# EAGLE design output board (EAGLE 9.6.2)
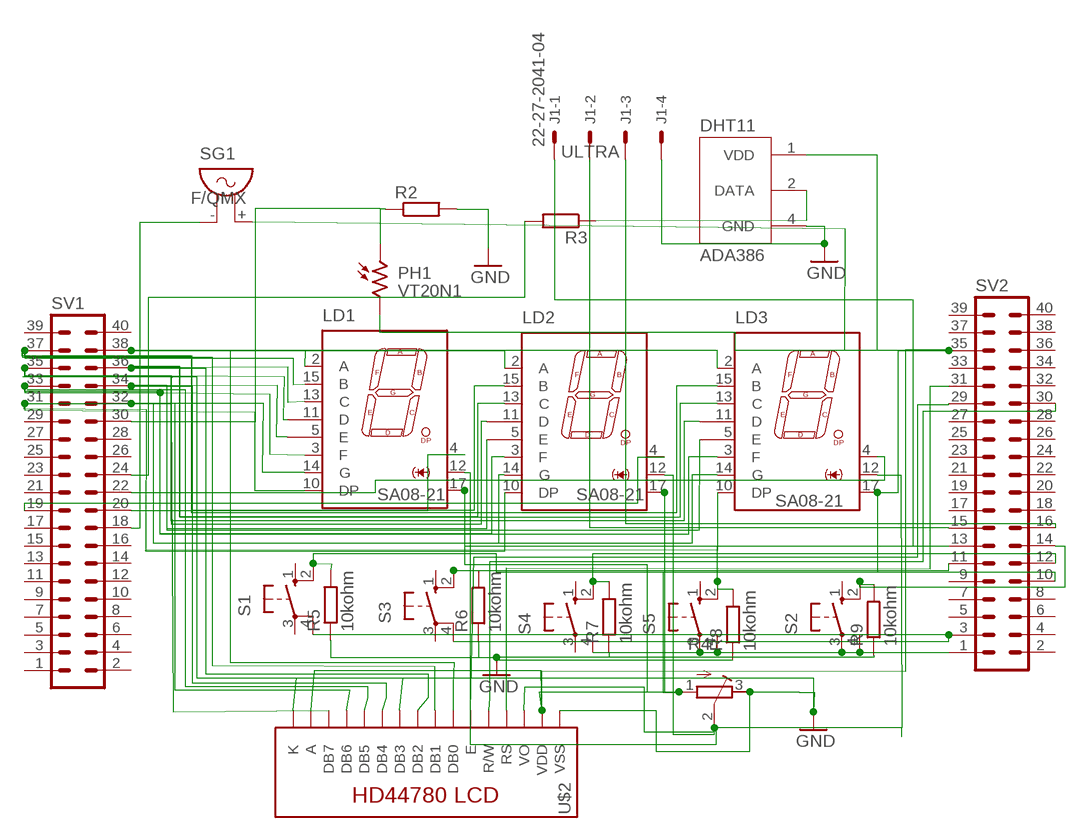
[diagram p0: schematic, sheet 1]

## Parts
DHT11  ADA386  [XDCR_ADA386]
J1  22-27-2041-04  [6410-04]
LD1  SA08-21  [SA08-21]
LD2  SA08-21  [SA08-21]
LD3  SA08-21  [SA08-21]
PH1  VT20N1  [TO46-VT200]
R2  R-EU_M0805  [M0805]
R3  R-EU_M0805  [M0805]
R4  R-TRIMM3224J  [RTRIM3224J]
R5  10kohm  R-EU_R0201  [R0201]
R6  10kohm  R-EU_R0201  [R0201]
R7  10kohm  R-EU_R0201  [R0201]
R8  10kohm  R-EU_R0201  [R0201]
R9  10kohm  R-EU_R0201  [R0201]
S1  10-XX  [B3F-10XX]
S2  10-XX  [B3F-10XX]
S3  10-XX  [B3F-10XX]
S4  10-XX  [B3F-10XX]
S5  10-XX  [B3F-10XX]
SG1  F/QMX  [F/QMX]
SV1  40P  [40P]
SV2  40P  [40P]
U$2  LCD-HD447803-HOLES16X2-3-HOLES  [LCD-16X2-3HOLES]

## Nets
GND: DHT11.4(GND) J1.4 R2.2 R4.3(E) R5.1 R6.1 R7.1 R8.1 R9.1 U$2.1(VSS) U$2.16(K)
N$1: DHT11.2(DATA) R3.1
N$2: U$2.12(DB5)
N$3: LD1.2(A) LD2.2(A) LD3.2(A) SV1.38 U$2.7(DB0)
N$4: LD1.15(B) LD2.15(B) LD3.15(B) SV1.37 U$2.8(DB1)
N$5: LD1.13(C) LD2.13(C) LD3.13(C) SV1.36 U$2.9(DB2)
N$6: LD1.9(D) LD2.9(D) LD3.9(D) SV1.35
N$7: LD1.7(E) LD2.7(E) LD3.7(E) SV1.34 U$2.11(DB4)
N$8: LD1.3(F) LD2.3(F) LD3.3(F) SV1.33
N$9: LD1.14(G) LD2.14(G) LD3.14(G) SV1.32 U$2.13(DB6)
N$10: LD1.10(DP) LD2.10(DP) LD3.10(DP) SV1.31 U$2.14(DB7)
N$11: SV2.29 U$2.6(E)
N$12: SV2.30 U$2.5(R/W)
N$13: SV2.31 U$2.4(RS)
N$14: LD1.12(AN) LD2.12(AN) LD3.12(AN) R4.2(S) U$2.3(VO)
N$15: PH1.1 R2.1
N$16: R5.2 S1.2(S1) SV2.10
N$17: U$2.10(DB3)
N$18: R6.2 S3.2(S1) SV2.11
N$19: R7.2 S4.2(S1) SV2.12
N$20: LD1.4(AN) SV1.20
N$21: LD2.4(AN) SV1.19
N$22: LD3.4(AN) SV1.22
N$23: R8.2 S5.2(S1) SV2.13
N$24: R9.2 S2.2(S1) SV2.14
N$25: S1.4(P1) S3.4(P1) SV2.3
N$26: S2.3(P) S2.4(P1) S4.4(P1) S5.3(P) S5.4(P1) SV2.1
N$27: R3.2 SV1.24
N$28: SV1.30
N$29: J1.2 SV2.15
N$30: SG1.- SV1.18
N$32: J1.3 SV2.16
ULTRA: DHT11.1(VDD) J1.1 LD1.17(AN) LD2.17(AN) LD3.17(AN) PH1.2 R4.1(A) SG1.+ SV2.35 U$2.2(VDD) U$2.15(A)
Unconnected: LD1.5(E) LD1.11(D) LD2.5(E) LD2.11(D) LD3.5(E) LD3.11(D) S1.1(S) S1.3(P) S2.1(S) S3.1(S) S3.3(P) S4.1(S) S4.3(P) S5.1(S) SV1.1 SV1.2 SV1.3 SV1.4 SV1.5 SV1.6 SV1.7 SV1.8 SV1.9 SV1.10 SV1.11 SV1.12 SV1.13 SV1.14 SV1.15 SV1.16 SV1.17 SV1.21 SV1.23 SV1.25 SV1.26 SV1.27 SV1.28 SV1.29 SV1.39 SV1.40 SV2.2 SV2.4 SV2.5 SV2.6 SV2.7 SV2.8 SV2.9 SV2.17 SV2.18 SV2.19 SV2.20 SV2.21 SV2.22 SV2.23 SV2.24 SV2.25 SV2.26 SV2.27 SV2.28 SV2.32 SV2.33 SV2.34 SV2.36 SV2.37 SV2.38 SV2.39 SV2.40

## Library data of the parts
DHT11 = ADA386:ADA386: DHT11 basic temperature-humidity sensor + extras; AVAILABILITY: Unavailable; DESCRIPTION: DHT11 basic temperature-humidity sensor + extras; MF: Adafruit Industries; MP: ADA386; PACKAGE: None; PRICE: None
J1 = con-molex:22-?-04: CONNECTOR wire to board 2.54 mm (.1 inch) pitch header; MF: MOLEX; OC_FARNELL: unknown; OC_NEWARK: unknown
LD1-LD3 = led:SA08-21: Kingbright 20mm (0.8Inch) Single Digit Numeric Display Source: SA08-11SRWA.pdf
PH1 = photo-elements:VT2*: Photoconductive Cell VT200 Series Source: http://optoelectronics.perkinelmer.com/content/Datasheets/DTS_vt200seriesdatasheet.pdf
R2 R3 R5-R9 = rcl:R-EU_: RESISTOR, European symbol; SPICEPREFIX: R
R4 = rcl:R-TRIMM: Trimm resistor; SPICEMODEL: X; SPICEPREFIXL: POT
S1-S5 = switch-omron:10-XX: OMRON SWITCH; MPN: B3F-1000; OC_FARNELL: 176432; OC_NEWARK: 36M3542
SG1 = buzzer:F/QMX: BUZZER Source: Buerklin; OC_FARNELL: unknown; OC_NEWARK: unknown
SV1 SV2 = con-dil:40P: DIL CABLE CONNECTOR
U$2 = HD44780LCD:LCD-HD44780

## Board
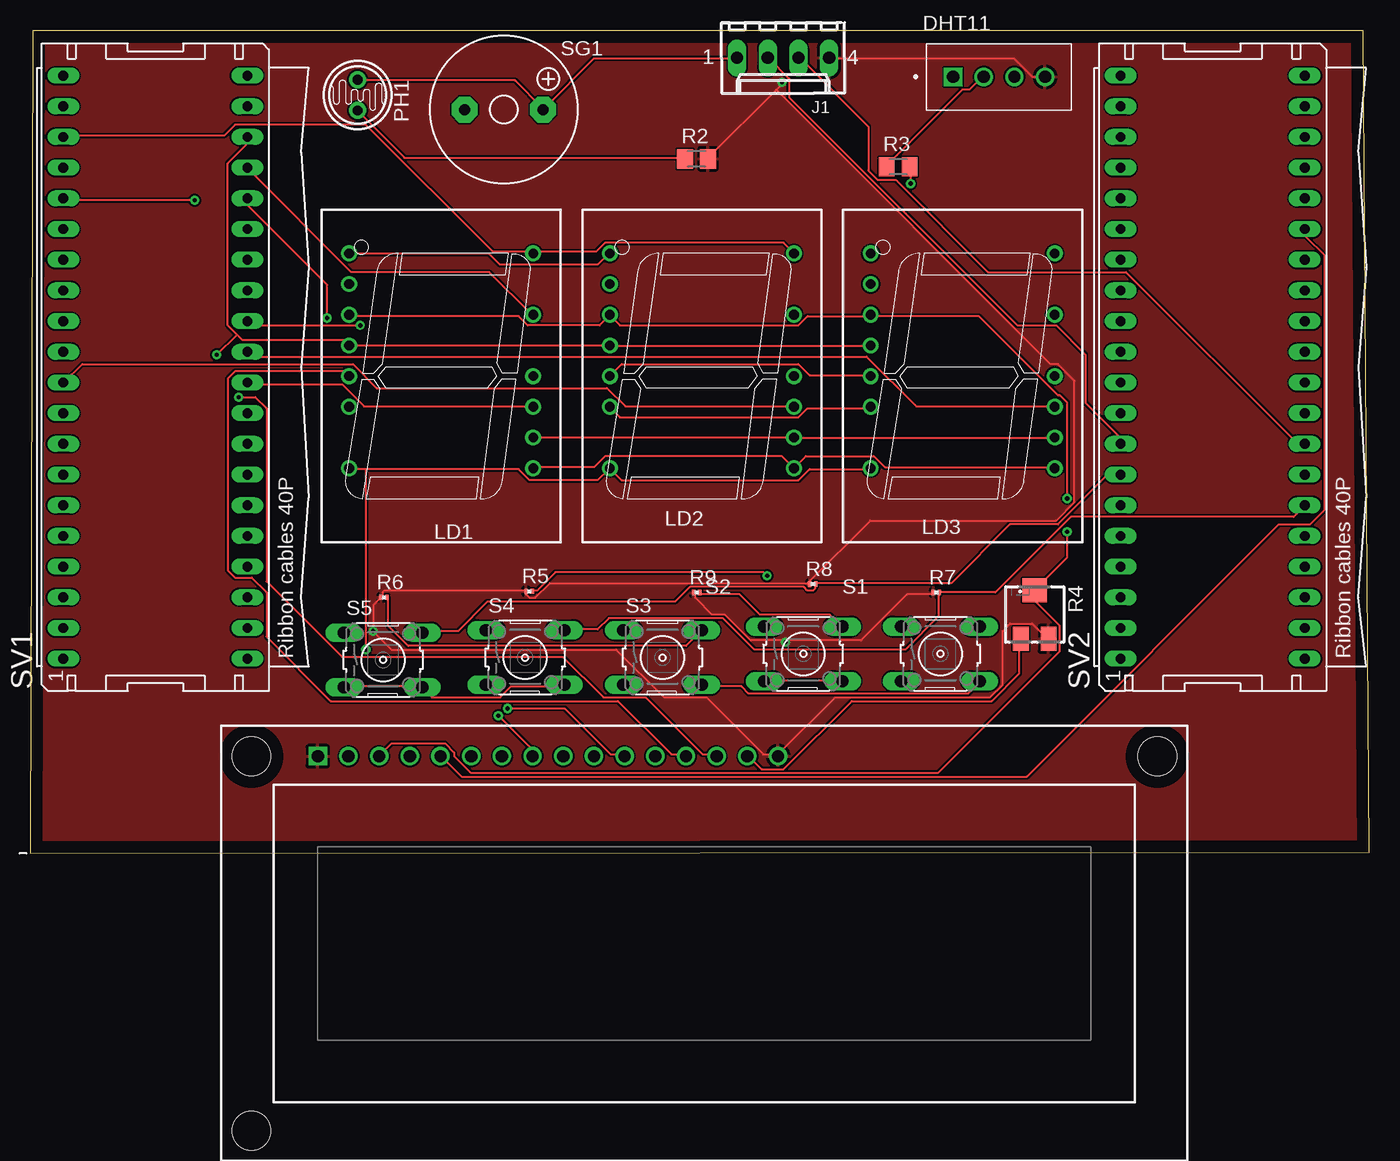
[diagram p1: board, top side]
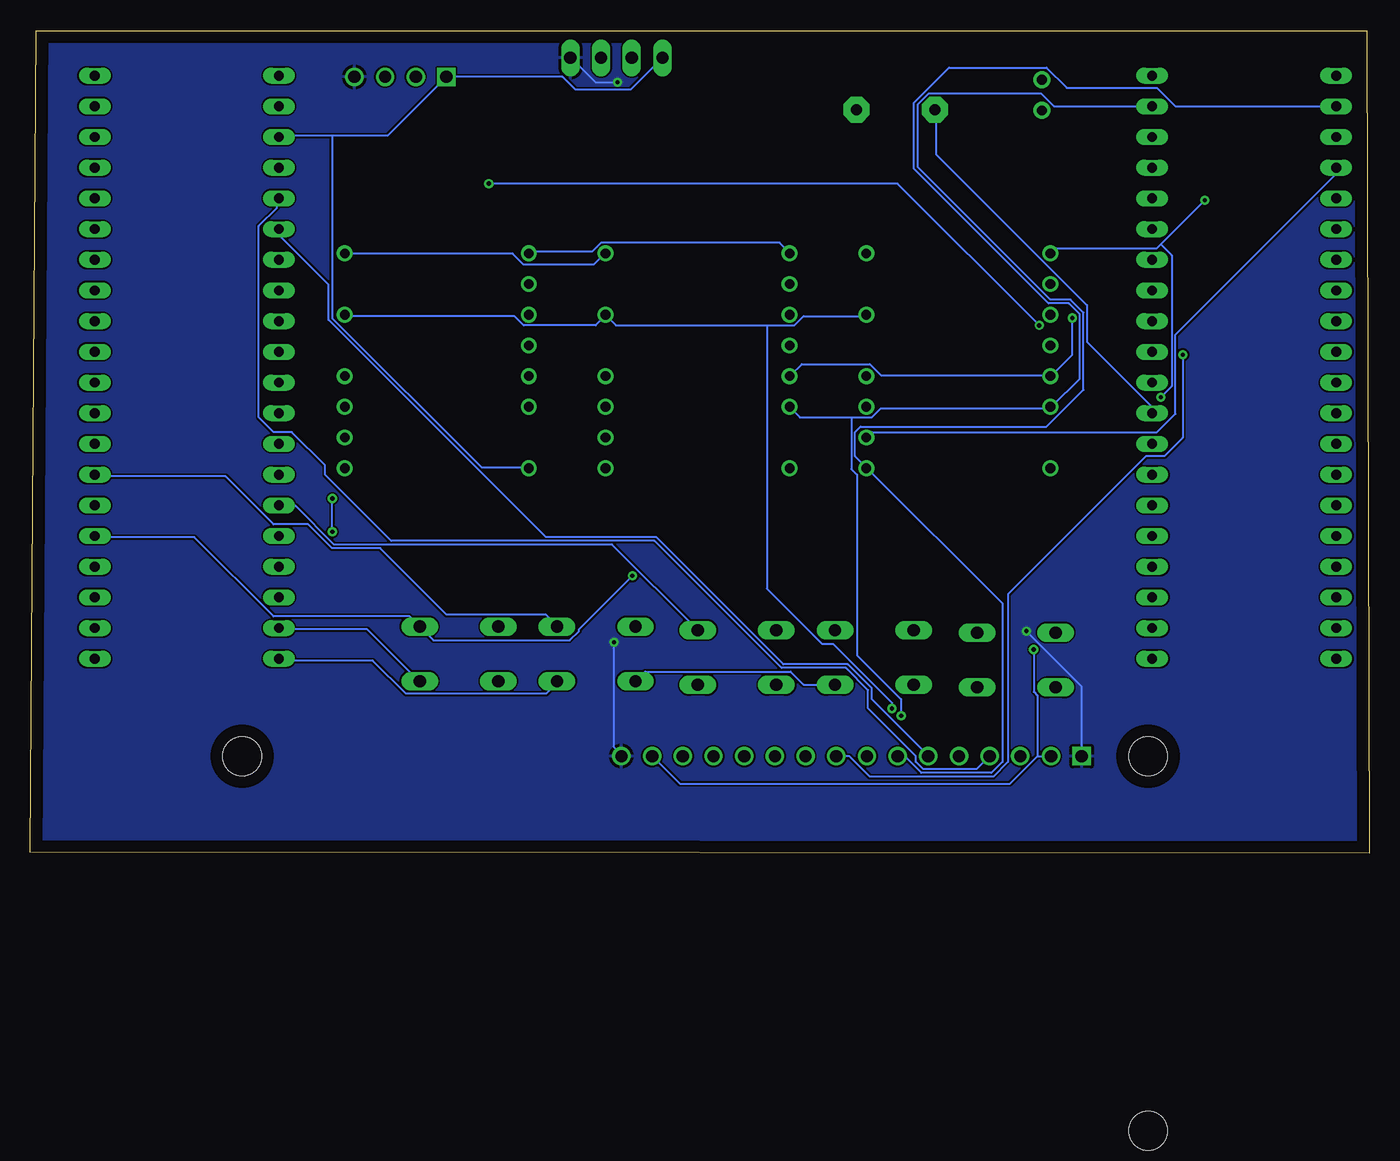
[diagram p2: board, bottom side, seen from below]

Size 110.86 x 68.06 mm. Coordinates in mm from the lower left corner, seen from the top.
Outline: 0,0 110.86,0.1 110.36,68.06 0.2,68.06 0,0
Copper layers (1*16): Top 0.035mm / dielectric 1.5mm / Bottom 0.035mm
Design rules "default": minimum track width 6mil, minimum drill 0.35mm, track to track 6mil, track to pad 6mil, pad to pad 6mil, via to via 6mil, smd to smd 6mil, copper to edge 40mil, drill to drill 6mil, minimum pad ring 10mil, minimum via ring 8mil, stop-mask expansion 4mil, vias tented up to drill 0mil, thermal gap 10mil

### Footprints (pad centres in the part's own frame; a part is rotated, then mirrored left to right if it is on the bottom)
XDCR_ADA386 = drill 1.016 square: 1 -3.81,0 | drill 1.016: 2 -1.27,0; 3 1.27,0; 4 3.81,0
6410-04 = drill 1.016 long: 1 3.81,0; 2 1.27,0; 3 -1.27,0; 4 -3.81,0
SA08-21 = drill 0.8 pad 1.27: 2 -7.62,7.62; 3 -7.62,5.08; 4 -7.62,2.54; 5 -7.62,0; 7 -7.62,-5.08; 9 -7.62,-10.16; 10 7.62,-10.16; 11 7.62,-7.62; 12 7.62,-5.08; 13 7.62,-2.54; 14 7.62,0; 15 7.62,2.54; 17 7.62,7.62
TO46-VT200 = drill 0.8 pad 1.4: 1 -1.27,0; 2 1.27,0
M0805 = smd 1.3 x 1.6: 1 -0.95,0; 2 0.95,0
RTRIM3224J = smd 1.3 x 2: 1 -1.15,-2; 3 1.15,-2 | smd 2 x 2: 2 0,2
R0201 = smd 0.28 x 0.43: 1 -0.255,0; 2 0.255,0
B3F-10XX = drill 1.016 long: 1 -3.251,2.261; 2 3.251,2.261; 3 -3.251,-2.261; 4 3.251,-2.261
F/QMX = drill 0.914 pad 2.159 octagon: + 3.251,0; - -3.251,0
40P = drill 0.813 long: 1 -24.13,7.62; 2 -24.13,-7.62; 3 -21.59,7.62; 4 -21.59,-7.62; 5 -19.05,7.62; 6 -19.05,-7.62; 7 -16.51,7.62; 8 -16.51,-7.62; 9 -13.97,7.62; 10 -13.97,-7.62; 11 -11.43,7.62; 12 -11.43,-7.62; 13 -8.89,7.62; 14 -8.89,-7.62; 15 -6.35,7.62; 16 -6.35,-7.62; 17 -3.81,7.62; 18 -3.81,-7.62; 19 -1.27,7.62; 20 -1.27,-7.62; 21 1.27,7.62; 22 1.27,-7.62; 23 3.81,7.62; 24 3.81,-7.62; 25 6.35,7.62; 26 6.35,-7.62; 27 8.89,7.62; 28 8.89,-7.62; 29 11.43,7.62; 30 11.43,-7.62; 31 13.97,7.62; 32 13.97,-7.62; 33 16.51,7.62; 34 16.51,-7.62; 35 19.05,7.62; 36 19.05,-7.62; 37 21.59,7.62; 38 21.59,-7.62; 39 24.13,7.62; 40 24.13,-7.62
LCD-16X2-3HOLES = drill 1.016 square: 1 -32,15.5 | drill 1.016: 2 -29.46,15.5; 3 -26.92,15.5; 4 -24.38,15.5; 5 -21.84,15.5; 6 -19.3,15.5; 7 -16.76,15.5; 8 -14.22,15.5; 9 -11.68,15.5; 10 -9.14,15.5; 11 -6.6,15.5; 12 -4.06,15.5; 13 -1.52,15.5; 14 1.02,15.5; 15 3.56,15.5; 16 6.1,15.5 | hole 3.2: -37.5,15.5; -37.5,-15.5; 37.5,15.5

### Placement (x,y rotation side)
DHT11  80.21,64.26 0 top
J1  62.33,65.83 180 top
LD1  34.02,39.49 180 top
LD2  55.61,39.49 180 top
LD3  77.2,39.49 180 top
PH1  27.11,62.75 90 top
R2  55.16,57.47 0 top
R3  71.86,56.81 0 top
R4  83.16,19.76 0 top
R5  41.31,21.68 0 top
R6  29.29,21.18 0 top
R7  75.02,21.58 0 top
R8  64.8,22.28 0 top
R9  55.18,21.58 0 top
S1  75.36,16.5 0 top
S2  64,16.5 0 top
S3  52.34,16.2 0 top
S4  40.98,16.2 0 top
S5  29.22,16 0 top
SG1  39.21,61.55 0 top
SV1  10.36,40.23 90 top
SV2  97.89,40.23 90 top
U$2  55.81,-7.46 0 top

### Tracks (layer width: path | path; a pad name or v marks a point on that pad's centre or on a via)
GND  (via drill 0.35)
  Top 0.152: 62.53,17.63 68.78,17.63 72.59,21.44 74.72,21.44 R7.1 | 62.53,17.63 59.64,17.63 57.5,19.76 56.44,19.76 55.06,21.13 55.06,21.44 R9.1 | R4.3 84.17,17.78 82.95,19 81.12,19 80.52,18.39 80.52,13.97 79.45,12.9 66.65,12.9 61.92,8.18 U$2.16 61.77,8.18 60.7,8.18 55.98,12.9 52.47,12.9 48.51,16.86 29.92,16.86 v28.39,18.39 28.39,20.52 29,21.13 R6.1 29.16,21.28 29.16,21.59 29.31,21.74 41.04,21.74 R5.1 41.04,21.59 41.04,21.44 41.35,21.13 41.8,21.13 43.02,22.35 64.36,22.35 | v62.53,17.47 62.53,17.63 | 61.77,63.19 62.23,63.65 v62.23,63.8 | 61.77,63.19 56.13,57.55 R2.2 | DHT11.4 82.95,64.26 81.43,65.78 66.19,65.78 J1.4 | 64.36,22.35 64.51,22.35 R8.1 | 61.77,63.19 84.48,40.49 85.09,40.49 86.46,39.11 86.46,29.06 84.93,27.53 69.54,27.53 64.36,22.35
  Bottom 0.152: v62.53,17.47 62.53,8.79 61.92,8.18 U$2.16 | v62.23,63.8 64.06,63.8 66.04,65.78 J1.4 | v28.39,18.39 23.82,13.82 23.82,8.18 U$2.1
  pour Top: -3.1,69.6 112.6,69.6 112.6,-23 112.6,-26.7 -4.9,-26.7 -4.9,69.6
  pour Bottom: -6.1,70.8 113.6,70.8 113.6,-28.1 -6.1,-28.1
N$1
  Top 0.152: R3.1 70.91,56.95 77.16,63.19 77.77,63.19 78.84,64.26 DHT11.2
N$3
  Top 0.152: LD1.2 41.65,31.95 46.68,31.95 47.6,32.87 62.23,32.87 63.14,31.95 LD2.2 63.29,31.95 64.21,32.87 69.85,32.87 70.76,31.95 84.78,31.95 LD3.2
  Bottom 0.152: SV1.38 18.03,61.82 26.11,61.82 27.18,62.89 36.47,62.89 37.39,61.97 37.39,56.79 26.41,45.82 24.74,45.82 23.67,44.75 23.67,38.35 26.72,35.3 42.11,35.3 42.57,34.85 42.57,32.87 41.65,31.95 LD1.2 41.5,31.8 30.38,20.67 30.38,7.57 31.29,6.65 37.08,6.65 38.45,8.02 38.91,8.02 U$2.7
N$4  (via drill 0.35)
  Top 0.152: LD3.15 69.54,36.83 64.36,36.83 63.6,36.07 48.82,36.07 48.05,36.83 LD2.15 | v38.76,11.38 41.5,8.63 41.5,8.18 U$2.8
  Bottom 0.152: 42.87,36.07 47.14,36.07 47.9,36.83 LD2.15 | 42.87,36.07 41.2,36.07 40.43,36.83 26.41,36.83 LD1.15 26.26,36.98 23.97,39.27 23.97,44.6 24.89,45.52 26.56,45.52 37.69,56.64 37.69,62.13 34.8,65.02 26.72,65.02 25.04,63.35 17.57,63.35 16.05,61.82 2.79,61.82 SV1.37 | v38.76,11.38 38.76,12.75 42.42,16.41 42.42,31.34 42.87,31.8 42.87,36.07
N$5  (via drill 0.35)
  Top 0.152: LD3.13 69.54,42.01 48.05,42.01 LD2.13 47.9,42.01 26.41,42.01 LD1.13 26.26,42.16 25.96,42.47 17.57,42.47 17.12,42.92 | 17.12,42.92 16.35,43.69 16.35,57.1 17.88,58.62 17.88,59.23 SV1.36 | 17.12,42.92 v15.44,41.25
  Bottom 0.152: v15.44,41.25 15.44,34.39 16.96,32.87 18.49,32.87 29.92,21.44 29.92,7.57 31.14,6.35 41.35,6.35 43.02,8.02 44.09,8.02 U$2.9
N$6
  Top 0.152: LD2.9 63.14,49.78 62.38,50.54 47.6,50.54 46.83,49.78 41.65,49.78 LD1.9 41.5,49.78 38.3,49.78 27.78,60.3 16.96,60.3 16.05,59.38 2.79,59.38 SV1.35
  Bottom 0.152: LD3.9 84.78,49.63 70.91,49.63 70,48.71 64.21,48.71 63.29,49.63 LD2.9
N$7  (via drill 0.35)
  Top 0.152: SV1.34 18.03,56.64 26.56,48.11 38,48.11 41.5,44.6 LD1.7 | v39.52,11.99 44.24,11.99 48.05,8.18 49.12,8.18 U$2.11
  Bottom 0.152: 49.88,43.69 62.38,43.69 63.14,44.45 LD2.7 63.29,44.45 64.06,43.69 70,43.69 70.76,44.45 84.78,44.45 LD3.7 | 49.88,43.69 47.6,43.69 46.83,44.45 41.65,44.45 LD1.7 | v39.52,11.99 39.52,12.44 44.4,17.32 45.31,17.32 49.88,21.89 49.88,43.69
N$8
  Top 0.152: LD1.3 41.65,34.39 63.14,34.39 LD2.3 63.29,34.39 84.78,34.39 LD3.3
  Bottom 0.152: SV1.33 2.79,56.64 2.79,56.18 16.05,42.92 16.05,36.37 17.57,34.85 41.2,34.85 41.5,34.54 LD1.3
N$9  (via drill 0.35)
  Top 0.152: LD3.14 69.54,39.57 64.51,39.57 63.6,40.49 48.97,40.49 48.05,39.57 LD2.14 | v24.58,44.3 24.58,47.04 18.03,53.59 18.03,54.05 SV1.32 | U$2.13 54.15,8.18 53.08,8.18 48.66,12.6 24.89,12.6 19.55,17.93 19.55,21.59 18.34,22.81 16.96,22.81 16.35,23.42 16.35,39.27 16.96,39.88 25.96,39.88 26.26,39.57 LD1.14
  Bottom 0.152: LD2.14 47.9,39.57 46.99,40.49 41.35,40.49 40.43,39.57 26.41,39.57 LD1.14 26.26,39.57 24.58,41.25 v24.58,44.3
N$10  (via drill 0.35)
  Top 0.152: LD1.10 26.41,49.63 38,49.63 38.91,48.71 46.99,48.71 47.9,49.63 LD2.10 | v13.61,54.05 2.79,54.05 SV1.31 | v17.27,37.74 18.64,37.74 19.55,36.83 19.55,22.5 25.8,16.25 44.09,16.25 47.44,12.9 50.95,12.9 55.67,8.18 56.74,8.18 U$2.14
  Bottom 0.152: LD3.10 69.54,49.78 64.36,49.78 63.6,50.54 48.82,50.54 48.05,49.78 LD2.10 | 17.27,50.39 17.57,50.09 25.96,50.09 26.26,49.78 LD1.10 | 17.27,50.39 v13.61,54.05 | v17.27,37.74 16.35,38.66 16.35,49.48 17.27,50.39
N$11
  Bottom 0.152: SV2.29 90.27,51.61 90.27,51.15 86.15,47.04 86.15,44.14 68.17,26.16 59.03,26.16 48.51,15.64 43.18,15.64 41.2,13.66 41.2,12.75 36.62,8.18 U$2.6
N$12
  Top 0.152: SV2.30 105.66,51.61 105.66,51 107.19,49.48 107.19,28.45 105.97,27.23 103.38,27.23 82.5,6.35 35.71,6.35 34.03,8.02 U$2.5
N$13
  Bottom 0.152: SV2.31 90.42,54.05 90.42,53.44 91.95,51.92 91.95,36.07 90.73,34.85 89.2,34.85 86.46,32.1 86.46,31.34 80.97,25.86 59.18,25.86 48.66,15.34 43.33,15.34 41.5,13.51 41.5,11.99 37.54,8.02 37.54,7.57 36.93,6.96 32.51,6.96 31.44,8.02 U$2.4
N$14  (via drill 0.35)
  Top 0.152: LD1.12 26.41,44.45 40.43,44.45 41.2,43.69 47.14,43.69 47.9,44.45 LD2.12 48.05,44.45 48.82,43.69 63.6,43.69 64.36,44.45 69.54,44.45 LD3.12 69.69,44.45 78.53,44.45 85.09,37.89 85.24,37.89 85.85,37.28 v85.85,29.36 | U$2.3 29,8.18 29.92,9.09 34.34,9.09 35.1,8.33 35.1,8.02 36.47,6.65 75.18,6.65 85.24,16.71 85.24,18.84 83.26,20.83 83.26,21.74 R4.2 83.26,21.89 85.85,24.48 v85.85,26.62
  Bottom 0.152: v85.85,26.62 v85.85,29.36
N$15
  Top 0.152: R2.1 54.15,57.55 30.98,57.55 27.18,61.36 PH1.1
N$16  (via drill 0.35)
  Top 0.152: v61.01,22.96 60.7,23.26 43.48,23.26 41.96,21.74 41.65,21.74 R5.2
  Bottom 0.152: v61.01,22.96 65.43,18.54 65.43,18.39 66.19,17.63 77.47,17.63 78.53,18.69 S1.2 78.69,18.84 79.45,19.61 90.73,19.61 97.28,26.16 105.51,26.16 SV2.10
N$18
  Top 0.152: R6.2 29.61,21.13 29.61,18.84 31.29,17.17 54.3,17.17 55.52,18.39 S3.2
  Bottom 0.152: SV2.11 90.27,28.75 88.9,28.75 85.7,25.55 62.68,25.55 55.67,18.54 S3.2
N$19
  Top 0.152: SV2.12 105.51,28.75 104.59,27.84 86.15,27.84 79.91,21.59 75.33,21.59 R7.2 75.18,21.44 75.18,19.61 72.44,16.86 59.94,16.86 57.35,19.45 47.9,19.45 46.99,18.54 44.24,18.54 S4.2
N$20
  Top 0.152: LD1.4 41.5,36.98 27.63,36.98 25.8,38.81 18.03,38.81 SV1.20
N$21
  Top 0.152: LD2.4 63.14,36.98 49.27,36.98 47.75,38.5 28.7,38.5 26.72,40.49 4.32,40.49 2.79,38.96 SV1.19
N$22
  Top 0.152: LD3.4 84.78,36.98 73.35,36.98 69.24,41.09 18.34,41.09 18.03,41.4 SV1.22
N$23
  Top 0.152: SV2.13 90.27,31.19 89.05,31.19 85.09,27.23 81.12,27.23 76.25,22.35 65.12,22.35 R8.2 64.97,22.2 64.97,21.89 64.82,21.74 64.36,21.74 64.06,22.05 54.61,22.05 53.39,20.83 37.84,20.83 35.4,18.39 32.51,18.39 S5.2
N$24
  Top 0.152: R9.2 55.52,21.44 58.72,21.44 60.4,19.76 66.19,19.76 67.1,18.84 S2.2
  Bottom 0.152: SV2.14 105.51,31.19 94.69,31.19 90.73,27.23 87.83,27.23 85.85,25.25 81.89,25.25 76.4,19.76 68.17,19.76 67.26,18.84 S2.2
N$25
  Top 0.152: S3.4 55.67,13.82 58.87,13.82 59.48,13.21 77.62,13.21 78.53,14.12 S1.4
  Bottom 0.152: SV2.3 90.27,18.54 82.95,18.54 78.69,14.27 S1.4
N$26
  Top 0.152: S5.3 26.11,13.82 32.36,13.82 S5.4 32.51,13.66 33.27,12.9 38.91,12.9 39.82,13.82 44.09,13.82 S4.4 | S2.3 60.86,14.27 67.1,14.27 S2.4
  Bottom 0.152: SV2.1 90.27,15.95 82.5,15.95 79.75,13.21 68.17,13.21 67.26,14.12 S2.4 | S4.4 44.24,13.97 46.83,13.97 47.9,15.04 59.94,15.04 60.7,14.27 S2.3
N$27  (via drill 0.35)
  Top 0.152: v72.89,55.42 72.89,56.79 R3.2 | v27.33,43.69 18.34,43.69 18.03,43.99 SV1.24
  Bottom 0.152: v72.89,55.42 39.06,55.42 v27.33,43.69
N$29
  Top 0.152: SV2.15 90.27,33.93 90.27,34.39 87.37,37.28 87.37,41.25 84.93,43.69 81.73,43.69 62.84,62.58 62.84,64.11 61.16,65.78 J1.2
N$30
  Bottom 0.152: SV1.18 18.03,36.52 18.03,36.98 23.36,42.31 23.36,45.36 35.86,57.86 35.86,61.52 SG1.-
N$32
  Top 0.152: SV2.16 105.51,33.93 104.9,33.93 90.73,48.11 79.3,48.11 71.68,55.73 70.15,55.73 69.39,56.49 69.39,60.14 63.75,65.78 J1.3
ULTRA  (via drill 0.35)
  Top 0.152: R4.1 81.89,17.63 81.89,14.88 79.6,12.6 68.02,12.6 62.38,6.96 60.55,6.96 59.48,8.02 U$2.15 | 27.78,31.8 40.43,31.8 41.35,30.88 46.99,30.88 47.9,31.8 LD2.17 48.05,31.8 48.97,30.88 63.6,30.88 64.51,31.8 69.54,31.8 LD3.17 | 27.78,31.8 26.41,31.8 LD1.17 | PH1.2 27.18,63.95 40.13,63.95 42.42,61.67 SG1.+ 42.57,61.67 46.68,65.78 58.42,65.78 J1.1 | 27.78,31.8 v27.78,16.86
  Bottom 0.152: 27.48,8.02 26.41,8.02 U$2.2 | 27.48,8.02 29.77,5.74 57.05,5.74 59.33,8.02 U$2.15 | 85.85,59.38 81.28,59.38 DHT11.1 66.8,64.26 65.73,63.19 61.16,63.19 58.57,65.78 J1.1 | 85.85,59.38 90.27,59.38 SV2.35 | 85.85,59.38 85.85,44.3 73.5,31.95 69.69,31.95 LD3.17 | 27.48,8.02 27.48,13.05 27.78,13.36 v27.78,16.86